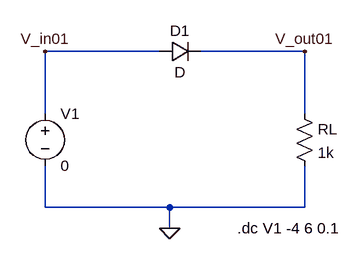
[diagram p0: schematic p02.asc]
p02.asc, the LTspice schematic file:
Version 4
SHEET 1 880 680
WIRE 112 96 -64 96
WIRE 336 96 176 96
WIRE -64 192 -64 96
WIRE 336 192 336 96
WIRE -64 336 -64 272
WIRE 128 336 -64 336
WIRE 336 336 336 272
WIRE 336 336 128 336
WIRE 128 368 128 336
FLAG 128 368 0
FLAG -64 96 V_in01
FLAG 336 96 V_out01
SYMBOL diode 112 112 R270
WINDOW 0 32 32 VTop 2
WINDOW 3 0 32 VBottom 2
SYMATTR InstName D1
SYMBOL voltage -64 176 R0
WINDOW 123 0 0 Left 0
WINDOW 39 0 0 Left 0
SYMATTR InstName V1
SYMATTR Value 0
SYMBOL res 320 176 R0
SYMATTR InstName RL
SYMATTR Value 1k
TEXT 232 368 Left 2 !.dc V1 -4 6 0.1

The netlist it stands for:
* p02.asc
D1 V_in01 V_out01 D
V1 V_in01 0 0
RL V_out01 0 1k
.model D D
.lib standard.dio
.dc V1 -4 6 0.1
.backanno
.end